# Altium project XY_Project.PrjPcb
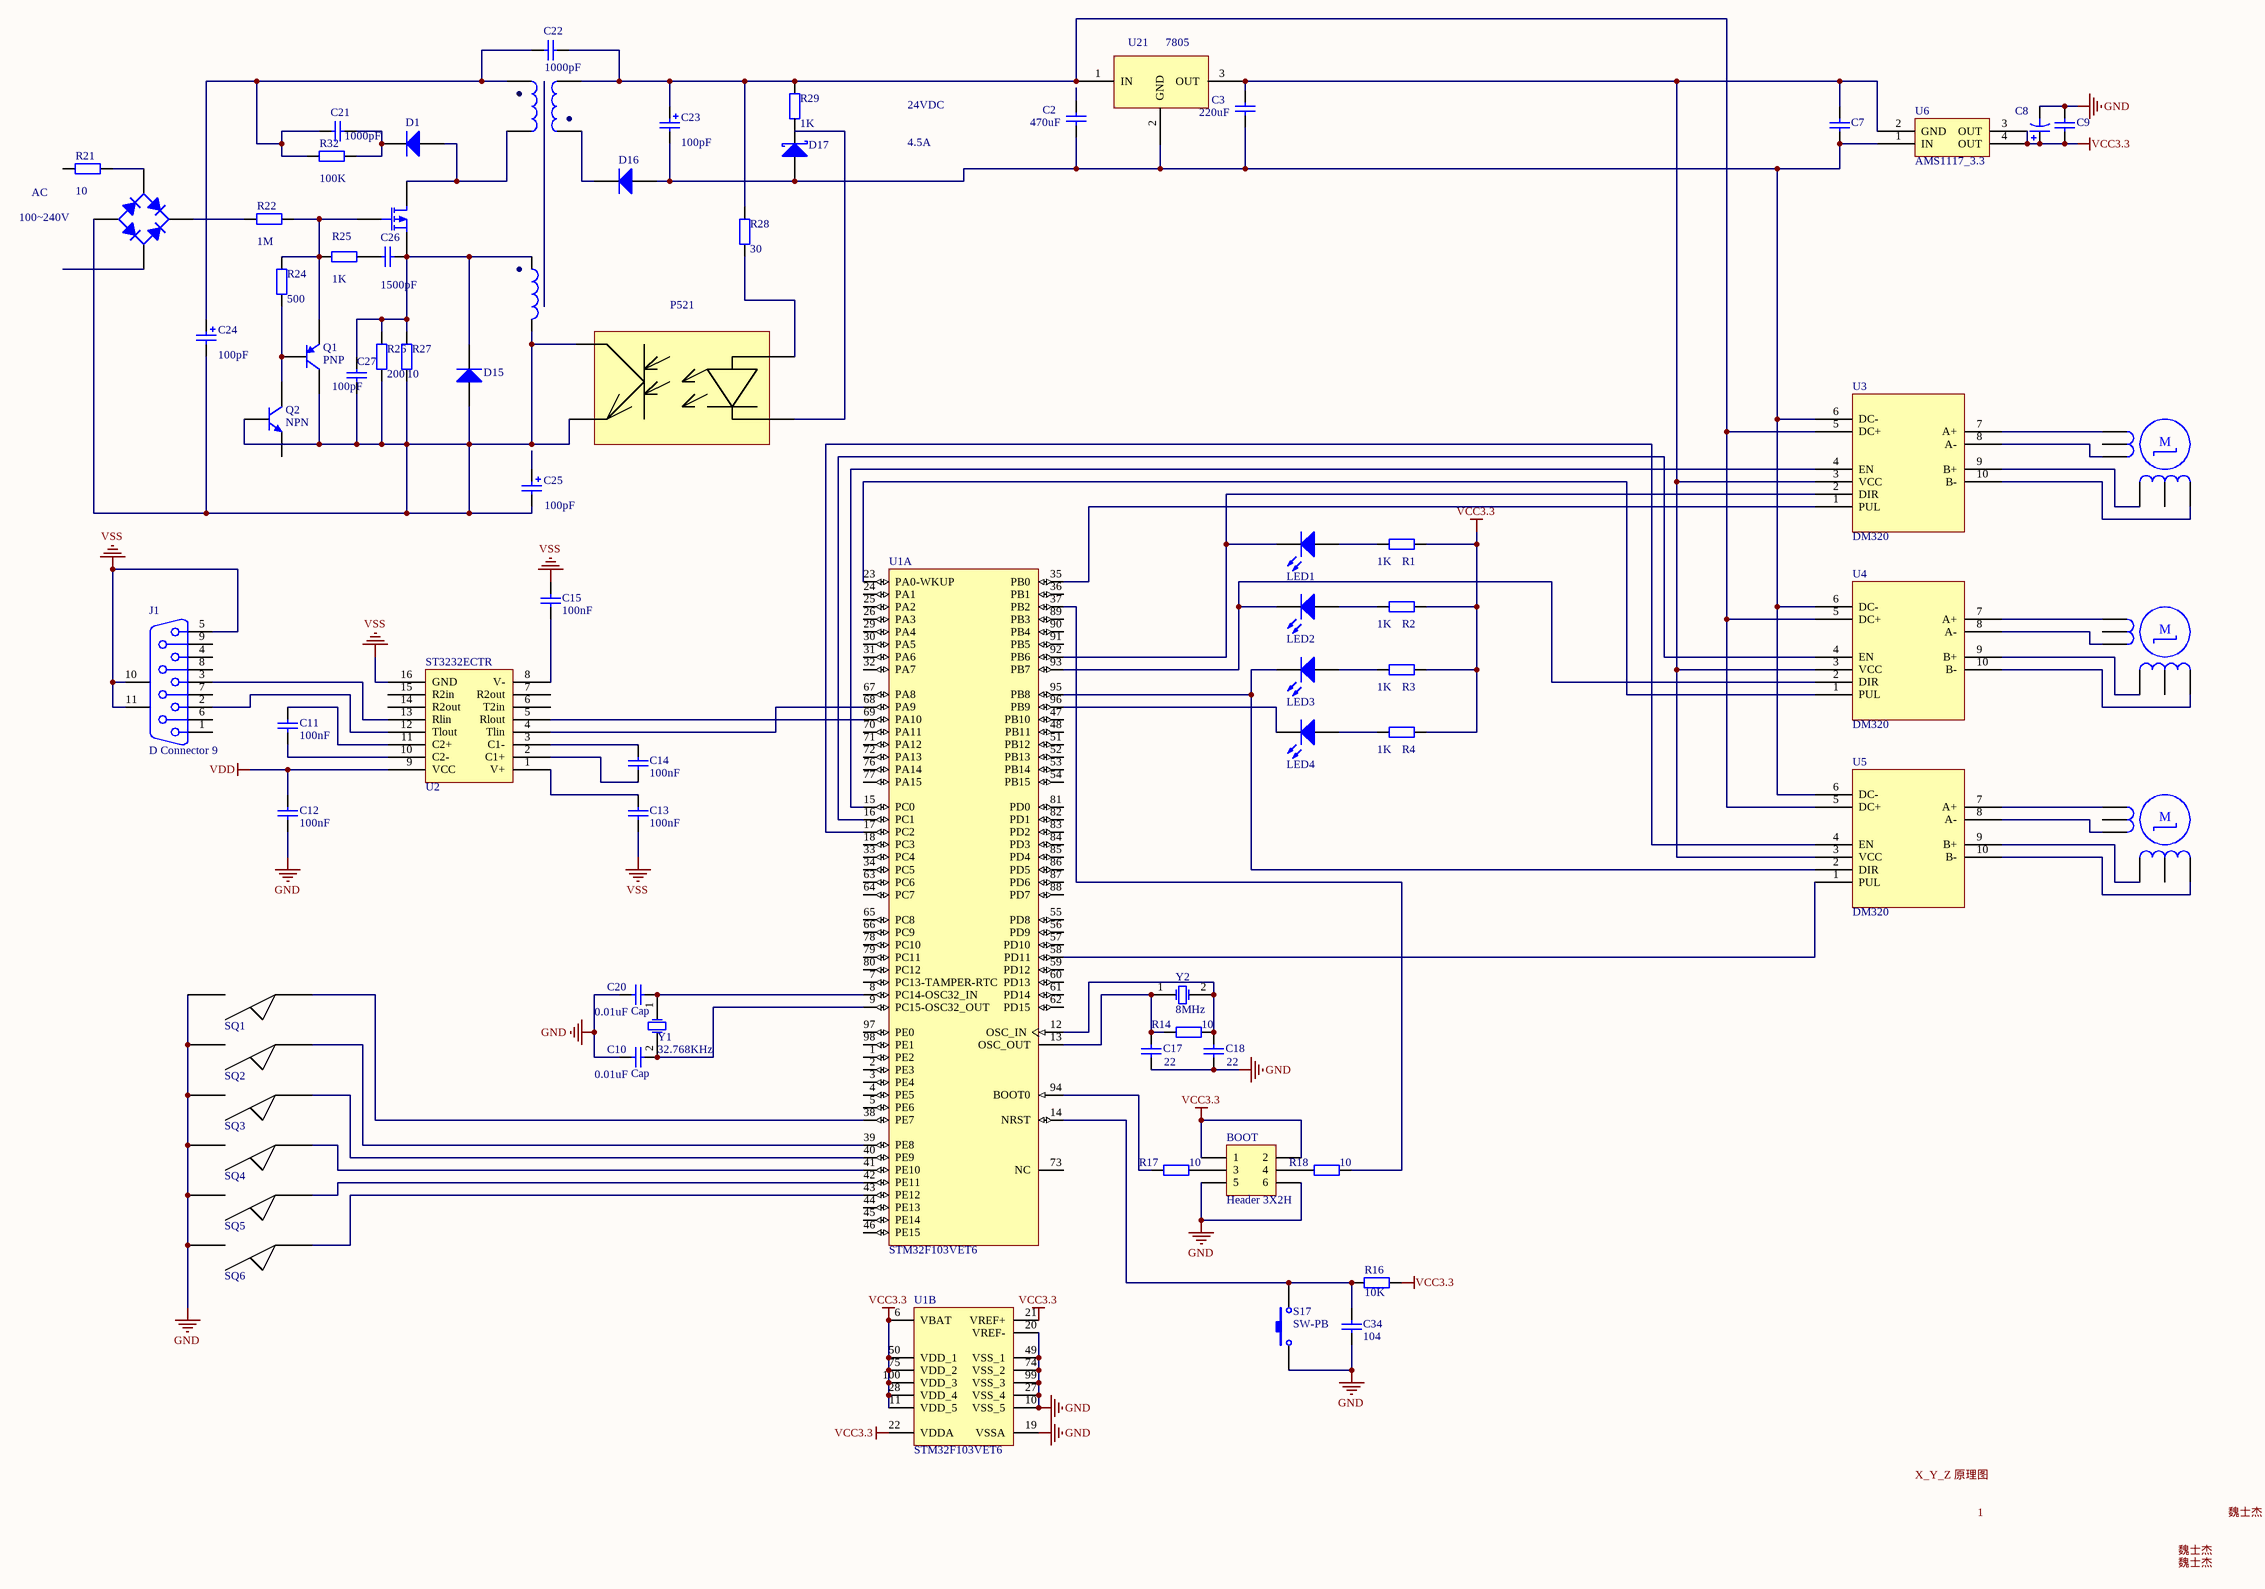
[diagram p0: X_Y_Z_PCB.SchDoc]
1 sheet, 75 parts. Net scope: global (net labels, ports and power ports of the same name join across sheets).

## Sheet X_Y_Z_PCB.SchDoc
size A2

### Parts
*  Component_1  (value not drawn)
B1  Motor Step  [DIP-6]  (value not drawn)
B2  Motor Step  [DIP-6]  (value not drawn)
B3  Motor Step  [DIP-6]  (value not drawn)
BOOT  Header 3X2H  [HDR2X3H]
C2  value 470uF  [0805C]  (hidden comment: Cap)
C3  value 220uF  [0805C]  (hidden comment: Cap)
C7  Cap  [0805C]  (value not drawn)
C8  Cap Pol3  [cap]  (value not drawn)
C9  Cap  [0805C]  (value not drawn)
C10  Cap  value 0.01uF  [RAD-0.3]
C11  value 100nF  [RAD-0.3]  (hidden comment: Cap)
C12  value 100nF  [RAD-0.3]  (hidden comment: Cap)
C13  value 100nF  [RAD-0.3]  (hidden comment: Cap)
C14  value 100nF  [RAD-0.3]  (hidden comment: Cap)
C15  value 100nF  [RAD-0.3]  (hidden comment: Cap)
C17  value 22  [RAD-0.3]  (hidden comment: Cap)
C18  value 22  [RAD-0.3]  (hidden comment: Cap)
C20  Cap  value 0.01uF  [RAD-0.3]
C21  value 1000pF  [RAD-0.3]  (hidden comment: Cap)
C22  value 1000pF  [C1206]  (hidden comment: Cap Semi)
C23  value 100pF  [POLAR0.8]  (hidden comment: Cap Pol2)
C24  value 100pF  [POLAR0.8]  (hidden comment: Cap Pol2)
C25  value 100pF  [POLAR0.8]  (hidden comment: Cap Pol2)
C26  value 1500pF  [RAD-0.3]  (hidden comment: Cap)
C27  value 100pF  [RAD-0.3]  (hidden comment: Cap)
C34  value 104  [0805C]  (hidden comment: Cap Semi)
D1  Diode 1N5402  [DO-201AD]  (value not drawn)
D2  LED2  [LED-0]
D3  LED3  [LED-0]
D4  LED4  [LED-0]
D5  LED1  [LED-0]
D15  Diode BAT18  [SOT-23_N]  (value not drawn)
D16  Diode 1N5404  [DO-201AD]  (value not drawn)
D17  Diode BAT17  [SOT-23_N]  (value not drawn)
D?  Bridge1  [D-38]  (value not drawn)
J1  D Connector 9  [DSUB1.385-2H9]
L?  Inductor  [0402-A]  (value not drawn)
Q1  PNP  [SOT-23B_N]
Q2  NPN  [TO-226-AA]
Q?  MOSFET-P  [E3]  (value not drawn)
R1  1K  [AXIAL-0.4]
R2  1K  [AXIAL-0.4]
R3  1K  [AXIAL-0.4]
R4  1K  [AXIAL-0.4]
R14  value 10  [AXIAL-0.4]
R16  value 10K  [0805R]  (hidden comment: Res2)
R17  value 10  [AXIAL-0.4]
R18  value 10  [AXIAL-0.4]
R21  value 10  [AXIAL-0.4]  (hidden comment: Res2)
R22  value 1M  [AXIAL-0.4]  (hidden comment: Res2)
R24  value 500  [AXIAL-0.4]  (hidden comment: Res2)
R25  value 1K  [AXIAL-0.4]  (hidden comment: Res2)
R26  value 200  [AXIAL-0.4]  (hidden comment: Res2)
R27  value 10  [AXIAL-0.4]  (hidden comment: Res2)
R28  value 30  [AXIAL-0.4]  (hidden comment: Res2)
R29  value 1K  [AXIAL-0.4]  (hidden comment: Res2)
R32  value 100K  [AXIAL-0.4]  (hidden comment: Res2)
S17  SW-PB  [SPST-2]
SQ1  SQ1
SQ2  SQ2
SQ3  SQ3
SQ4  SQ4
SQ5  SQ5
SQ6  SQ6
ST3232ECTR  U2
T?  Trans  [TRANS]  (value not drawn)
U1  STM32F103VET6  [STM-LQFP100_N]  (parts A,B of 2)
U3  DM320
U4  DM320
U5  DM320
U6  AMS1117_3.3
U21  7805  [LM7805]
Y1  32.768KHz  [R38]
Y2  8MHz  [R38]

### Nets
GND: BOOT.5 BOOT.6 C8.2 C9.2 C10.1 C12.2 C17.1 C18.1 C20.1 C34.2 S17.1 SQ1.18(GND) SQ2.18(GND) SQ3.18(GND) SQ4.18(GND) SQ5.18(GND) SQ6.18(GND) U1.10(VSS_5) U1.19(VSSA) U1.20(VREF-) U1.27(VSS_4) U1.49(VSS_1) U1.74(VSS_2) U1.99(VSS_3)
VCC3.3: BOOT.1 BOOT.2 C8.1 C9.1 R1.2 R2.2 R3.2 R4.2 R16.1 U1.6(VBAT) U1.11(VDD_5) U1.21(VREF+) U1.22(VDDA) U1.28(VDD_4) U1.50(VDD_1) U1.75(VDD_2) U1.100(VDD_3) U6.3(OUT) U6.4(OUT)
VDD: C12.1 ST3232ECTR.9(VCC)
VSS: C13.2 C15.1 J1.5 J1.10(MH1) J1.11(MH2) ST3232ECTR.16(GND)
NetB1_1: B1.1 U3.7(A+)
NetB1_3: B1.3 U3.8(A-)
NetB1_4: B1.4 U3.9(B+)
NetB1_6: B1.6 U3.10(B-)
NetB2_1: B2.1 U4.7(A+)
NetB2_3: B2.3 U4.8(A-)
NetB2_4: B2.4 U4.9(B+)
NetB2_6: B2.6 U4.10(B-)
NetB3_1: B3.1 U5.7(A+)
NetB3_3: B3.3 U5.8(A-)
NetB3_4: B3.4 U5.9(B+)
NetB3_6: B3.6 U5.10(B-)
NetBOOT_3: BOOT.3 R17.2
NetBOOT_4: BOOT.4 R18.1
NetC2_1: C2.1 C3.1 C7.1 C23.2 D16.1(A) D17.1(A) U3.6(DC-) U4.6(DC-) U5.6(DC-) U6.1(IN) U21.2(GND)
NetC3_2: C3.2 C7.2 U3.3(VCC) U4.3(VCC) U5.3(VCC) U6.2(GND) U21.3(OUT)
NetC10_2: C10.2 U1.9(PC15-OSC32_OUT) Y1.2(OSC2)
NetC11_1: C11.1 ST3232ECTR.11(C2+)
NetC11_2: C11.2 ST3232ECTR.10(C2-)
NetC13_1: C13.1 ST3232ECTR.1(V+)
NetC14_1: C14.1 ST3232ECTR.3(C1-)
NetC14_2: C14.2 ST3232ECTR.2(C1+)
NetC15_2: C15.2 ST3232ECTR.8(V-)
NetC17_2: C17.2 R14.1 U1.13(OSC_OUT) Y2.1(OSC1)
NetC18_2: C18.2 R14.2 U1.12(OSC_IN) Y2.2(OSC2)
NetC20_2: C20.2 U1.8(PC14-OSC32_IN) Y1.1(OSC1)
NetC21_1: C21.1 C22.1 C24.1 R32.1 T?.1
NetC21_2: C21.2 D1.2(K) R32.2
NetC22_2: C22.2 C23.1 R28.2 R29.2 T?.3 U3.5(DC+) U4.5(DC+) U5.5(DC+) U21.1(IN)
NetC24_2: C24.2 C25.2 C27.1 D15.1(A) D?.3(A) L?.2 Q1.1(C) Q2.2(B) R26.1 R27.1
NetC26_1: C26.1 R25.2
NetC26_2: C26.2 C27.2 D15.3(K) L?.1 Q?.3(S) R26.2 R27.2
NetC34_1: C34.1 R16.2 S17.2 U1.14(NRST)
NetD1_1: D1.1(A) Q?.1(D) T?.2
NetD2_1: D2.1(A) R2.1
NetD2_2: D2.2(K) U1.93(PB7) U4.2(DIR)
NetD3_1: D3.1(A) R3.1
NetD3_2: D3.2(K) U1.95(PB8) U5.2(DIR)
NetD4_1: D4.1(A) R4.1
NetD4_2: D4.2(K) U1.96(PB9)
NetD5_1: D5.1(A) R1.1
NetD5_2: D5.2(K) U1.92(PB6) U3.2(DIR)
NetD16_2: D16.2(K) T?.4
NetD?_1: D?.1(K) R22.1
NetD?_4: D?.4(C) R21.2
NetJ1_2: J1.2 ST3232ECTR.12(Tlout)
NetJ1_3: J1.3 ST3232ECTR.13(Rlin)
NetQ1_2: Q1.2(B) Q2.1(C) R24.1
NetQ1_3: Q1.3(E) Q?.2(G) R22.2 R24.2 R25.1
NetR17_1: R17.1 U1.94(BOOT0)
NetR18_2: R18.2 U1.37(PB2)
NetSQ1_17: SQ1.17(GND) U1.38(PE7)
NetSQ2_17: SQ2.17(GND) U1.39(PE8)
NetSQ3_17: SQ3.17(GND) U1.40(PE9)
NetSQ4_17: SQ4.17(GND) U1.41(PE10)
NetSQ5_17: SQ5.17(GND) U1.42(PE11)
NetSQ6_17: SQ6.17(GND) U1.43(PE12)
NetST3232ECTR_4: ST3232ECTR.4(Tlin) U1.68(PA9)
NetST3232ECTR_5: ST3232ECTR.5(Rlout) U1.69(PA10)
NetU1_15: U1.15(PC0) U3.4(EN)
NetU1_16: U1.16(PC1) U4.4(EN)
NetU1_17: U1.17(PC2) U5.4(EN)
NetU1_23: U1.23(PA0-WKUP) U4.1(PUL)
NetU1_35: U1.35(PB0) U3.1(PUL)
NetU1_58: U1.58(PD11) U5.1(PUL)

Not connected (* = marked no-connect by the designer): B1 2 5; B2 2 5; B3 2 5; C2 2; C25 1; D17 3(K); D? 2(C); J1 1 4 6 7 8 9; Q2 3(E); R21 1; R28 1; R29 1; ST3232ECTR 6(T2in) 7(R2out) 14(R2out) 15(R2in); U1 1(PE2) 2(PE3) 3(PE4) 4(PE5) 5(PE6) 7(PC13-TAMPER-RTC) 18(PC3) 24(PA1) 25(PA2) 26(PA3) 29(PA4) 30(PA5) 31(PA6) 32(PA7) 33(PC4) 34(PC5) 36(PB1) 44(PE13) 45(PE14) 46(PE15) 47(PB10) 48(PB11) 51(PB12) 52(PB13) 53(PB14) 54(PB15) 55(PD8) 56(PD9) 57(PD10) 59(PD12) 60(PD13) 61(PD14) 62(PD15) 63(PC6) 64(PC7) 65(PC8) 66(PC9) 67(PA8) 70(PA11) 71(PA12) 72(PA13) 73(NC) 76(PA14) 77(PA15) 78(PC10) 79(PC11) 80(PC12) 81(PD0) 82(PD1) 83(PD2) 84(PD3) 85(PD4) 86(PD5) 87(PD6) 88(PD7) 89(PB3) 90(PB4) 91(PB5) 97(PE0) 98(PE1)

### Notes on the sheet
- 24VDC
- 4.5A
- 100~240V
- (near R21) AC
- P521
- Labels drawn without touching a wire or pin: 1, X_Y_Z 原理图, 魏士杰
- (in symbol Motor Step) M

### Library data of the parts
B1-B3 = Motor Step: Motor Stepper; Published: 24-Mar-1999; LatestRevisionDate: 17-Jul-2002; LatestRevisionNote: Re-released for DXP Platform.; PackageReference: DIP-6; Publisher: Altium Limited; Code_JEDEC: MO-001-AM
BOOT = Header 3X2H: Header, 3-Pin, Dual row, Right Angle; LatestRevisionDate: 17-Jul-2002; LatestRevisionNote: Re-released for DXP Platform.; Publisher: Altium Limited
C2 C3 C7 C9-C15 C17 C18 C20 C21 C26 C27 = Cap: Capacitor; Published: 8-Jun-2000; LatestRevisionDate: 17-Jul-2002; LatestRevisionNote: Re-released for DXP Platform.; PackageReference: RAD-0.3; Publisher: Altium Limited
  C10-C15 C17 C18 C20 C21 C26 C27: PackageDescription: Radial Cap, Thru-Hole; 2 Leads; 0.3 in Pin Spacing
C8 = Cap Pol3: Polarized Capacitor (Surface Mount); Published: 8-Jun-2000; LatestRevisionDate: 17-Jul-2002; LatestRevisionNote: Re-released for DXP Platform.; PackageReference: C0805; Publisher: Altium Limited
C22 C34 = Cap Semi: Capacitor (Semiconductor SIM Model); Published: 8-Jun-2000; LatestRevisionDate: 29-May-2009; LatestRevisionNote: IPC-7351 Footprint Added.; PackageReference: C1206; Publisher: Altium Limited; PackageDescription: Chip Capacitor
C23-C25 = Cap Pol2: Polarized Capacitor (Axial); Published: 8-Jun-2000; LatestRevisionDate: 17-Jul-2002; LatestRevisionNote: Re-released for DXP Platform.; PackageReference: POLAR0.8; Publisher: Altium Limited; PackageDescription: Polarized Capacitor; 2 Leads
D1 = Diode 1N5402: 3 Amp General Purpose Rectifier; Published: 8-Jun-2000; LatestRevisionDate: 17-Jul-2002; LatestRevisionNote: Re-released for DXP Platform.; DatasheetVersion: 1998; PackageVersion: Aug-1999; PackageReference: DO-201AD; Publisher: Altium Limited; PackageDescription: Diode, Axial; Body 9.5 x 5.6 mm (LxDia. max), Lead Dia. 1.32 mm (max); ComponentLink1Description: Manufacturer Link; ComponentLink1URL: http://www.fairchildsemi.com/; ComponentLink2Description: Datasheet; ComponentLink2URL: http://www.fairchildsemi.com/ds/1N%2F1N5400.pdf
D2-D5 = LED0: Typical INFRARED GaAs LED; Published: 8-Jun-2000; LatestRevisionDate: 08-Jul-2005; LatestRevisionNote: Mech Layer 1 removed.; PackageReference: LED-0; Publisher: Altium Limited; PackageDescription: LED; 2 Leads
D15 = Diode BAT18: Low-Loss RF Switching Diode; Note: Pin 2 is not connected and not drawn.; Published: 21-Mar-2003; LatestRevisionDate: 29-May-2009; LatestRevisionNote: IPC-7351 Footprint Added.; DatasheetVersion: Oct-1999; PackageVersion: Sep-2001; PackageReference: SOT-23; Publisher: Altium Limited; PackageDescription: 3-Pin SOT-23 Package 0.95 mm Pitch, 2.5 mm Lead Span; ComponentLink1Description: Manufacturer Link; ComponentLink1URL: http://www.infineon.com/
D16 = Diode 1N5404: 3 Amp General Purpose Rectifier; Published: 8-Jun-2000; LatestRevisionDate: 17-Jul-2002; LatestRevisionNote: Re-released for DXP Platform.; DatasheetVersion: 1998; PackageVersion: Aug-1999; PackageReference: DO-201AD; Publisher: Altium Limited; PackageDescription: Diode, Axial; Body 9.5 x 5.6 mm (LxDia. max), Lead Dia. 1.32 mm (max); ComponentLink1Description: Manufacturer Link; ComponentLink1URL: http://www.fairchildsemi.com/; ComponentLink2Description: Datasheet; ComponentLink2URL: http://www.fairchildsemi.com/ds/1N%2F1N5400.pdf
D17 = Diode BAT17: Silicon RF Schottky Diode for Mixer Applications in the VHF/UHF Range; Note: Pin 2 is not connected and not drawn.; Published: 21-Mar-2003; LatestRevisionDate: 29-May-2009; LatestRevisionNote: IPC-7351 Footprint Added.; DatasheetVersion: Oct-1999; PackageVersion: Sep-2001; PackageReference: SOT-23; Publisher: Altium Limited; PackageDescription: 3-Pin SOT-23 Package 0.95 mm Pitch, 2.5 mm Lead Span; ComponentLink1Description: Manufacturer Link; ComponentLink1URL: http://www.infineon.com/; ComponentLink2Description: Datasheet; ComponentLink2URL: http://www.infineon.com/upload/Document/cmc_upload/documents/009/363/bat17series.pdf
D? = Bridge1: Full Wave Diode Bridge; Published: 8-Jun-2000; LatestRevisionDate: 29-May-2009; LatestRevisionNote: Sch pins A & K swapped.; DatasheetVersion: E2732B; PackageReference: D-38; Publisher: Altium Limited; PackageDescription: Bridge Rectifier; 4 Terminals; Body 9.4 x 9.4 mm (typ); Pitch 5.08 mm
J1 = D Connector 9: Receptacle Assembly, 9 Position, Right Angle; PackageDocument: O; Positions: 9; Published: 15-Jun-2001; LatestRevisionDate: 17-Jul-2002; LatestRevisionNote: Re-released for DXP Platform.; DatasheetDocument: 1-Sep-1999; PackageReference: 788750; Publisher: Altium Limited; Orientation: Right Angle; Gender: Receptacle
L? = Inductor: Code_IEC: 1005; Value: 10mH; Published: 8-Jun-2000; LatestRevisionDate: 29-May-2009; LatestRevisionNote: IPC-7351 Footprint Added.; PackageReference: 0402-A; Publisher: Altium Limited; PackageDescription: Chip Inductor; Code_JEITA: 0402
Q1 = PNP: PNP Bipolar Transistor; Published: 8-Jun-2000; LatestRevisionDate: 29-May-2009; LatestRevisionNote: IPC-7351 Footprint Added.; PackageVersion: Aug-1999; PackageReference: SOT-23B; Publisher: Altium Limited; PackageDescription: 3-Pin SOT-23 Package 0.95 mm Pitch, 2.4 mm Lead Span
Q2 = NPN: NPN Bipolar Transistor; Published: 8-Jun-2000; LatestRevisionDate: 17-Jul-2002; LatestRevisionNote: Re-released for DXP Platform.; PackageReference: TO-226-AA; Publisher: Altium Limited; PackageDescription: TO, Flat Index; 3 In-Line, Axial Leads; Body Dia. 4.8mm; Leads 0.55 x 0.51 mm (max); Code_JEDEC: TO-226-AA
Q? = MOSFET-P: P-Channel MOSFET; Published: 8-Jun-2000; LatestRevisionDate: 17-Jul-2002; LatestRevisionNote: Re-released for DXP Platform.; PackageVersion: 1995/1996; PackageReference: E3; Publisher: Altium Limited; PackageDescription: TO, Flat Index; 3 In-Line, Axial Leads; Body Dia. 4.6mm; Lead Dia. 0.5 mm (max)
R1-R4 R14 R16-R18 R21 R22 R24-R29 R32 = Res2: Resistor; Published: 8-Jun-2000; LatestRevisionDate: 17-Jul-2002; LatestRevisionNote: Re-released for DXP Platform.; PackageReference: AXIAL-0.4; Publisher: Altium Limited; PackageDescription: Axial Device, Thru-Hole; 2 Leads; 0.4 in Pin Spacing
S17 = SW-PB: Switch; Published: 24-Mar-1999; LatestRevisionDate: 17-Jul-2002; LatestRevisionNote: Re-released for DXP Platform.; PackageReference: SPST-2; Publisher: Altium Limited; PackageDescription: Switch; 2 Leads
SQ1-SQ6 ST3232ECTR U3-U5 = Component_1
T? = Trans: Transformer; Published: 24-Mar-1999; LatestRevisionDate: 08-Jul-2005; LatestRevisionNote: Mech Layer 1 removed.; PackageReference: TRANS; Publisher: Altium Limited; PackageDescription: Transformer; 4 Leads
U1 = STM32F103VET6: ARM Cortex-M3 32-bit MCU, 512 KB Flash, 64 KB Internal RAM, 80 I/Os, 100-pin LQFP, -40 to 85 degC, Tray; A/D Converter: 3x12-bit (16 Channel); D/A Converter: 2x12-bit (2 Channel); FLASH Size (Prog) (kB): 512; I/Os (High Current): 80; Internal RAM Size (kB): 64; Operating Frequency(F) (Processor speed) (MHz): 72; Supply Voltage(Vcc) min (V): 2; DatasheetVersion: Rev. 8; PackageVersion: Rev. 1, 06/2013; PackageReference: LQFP100; PackageDescription: 100-Pin Low Profile Quad Flat Package, 14 x 14 mm Body, 0.5 mm Pitch; Supplier 1: Digi-Key; Supplier Part Number 1: 497-6443-ND; Supplier 2: Farnell; Supplier Part Number 2: 1624141; Supplier 3: Newark; Supplier Part Number 3: 01P4104; Supplier 4: Newark; Supplier Part Number 4: 57P1260; Supplier 5: Mouser; Supplier Part Number 5: 511-STM32F103VET6; Core: ARM Cortex-M3; Packing: Tray; Mounting Technology: Surface Mount; PartNumber: STM32F103VET6; ComponentLink1Description: Manufacturer URL; ComponentLink1URL: http://www.st.com/web/en/home.html; ComponentLink2Description: Datasheet; ComponentLink2URL: http://www.st.com/st-web-ui/static/active/en/resource/technical/document/datasheet/CD00191185.pdf; ComponentLink3Description: Package Specification; ComponentLink3URL: http://www.st.com/st-web-ui/static/active/en/resource/technical/document/data_brief/DM00071938.pdf
U6 = LM33
U21 = LM7805
Y1 Y2 = XTAL: Crystal Oscillator; Published: 8-Jun-2000; LatestRevisionDate: 17-Jul-2002; LatestRevisionNote: Re-released for DXP Platform.; PackageReference: R38; Publisher: Altium Limited; PackageDescription: Crystal, Thru-Hole; 2 Leads; Body 3.1 x 8.2 mm (Dia.xH)